# EAGLE design untitled (EAGLE 9.6.1)
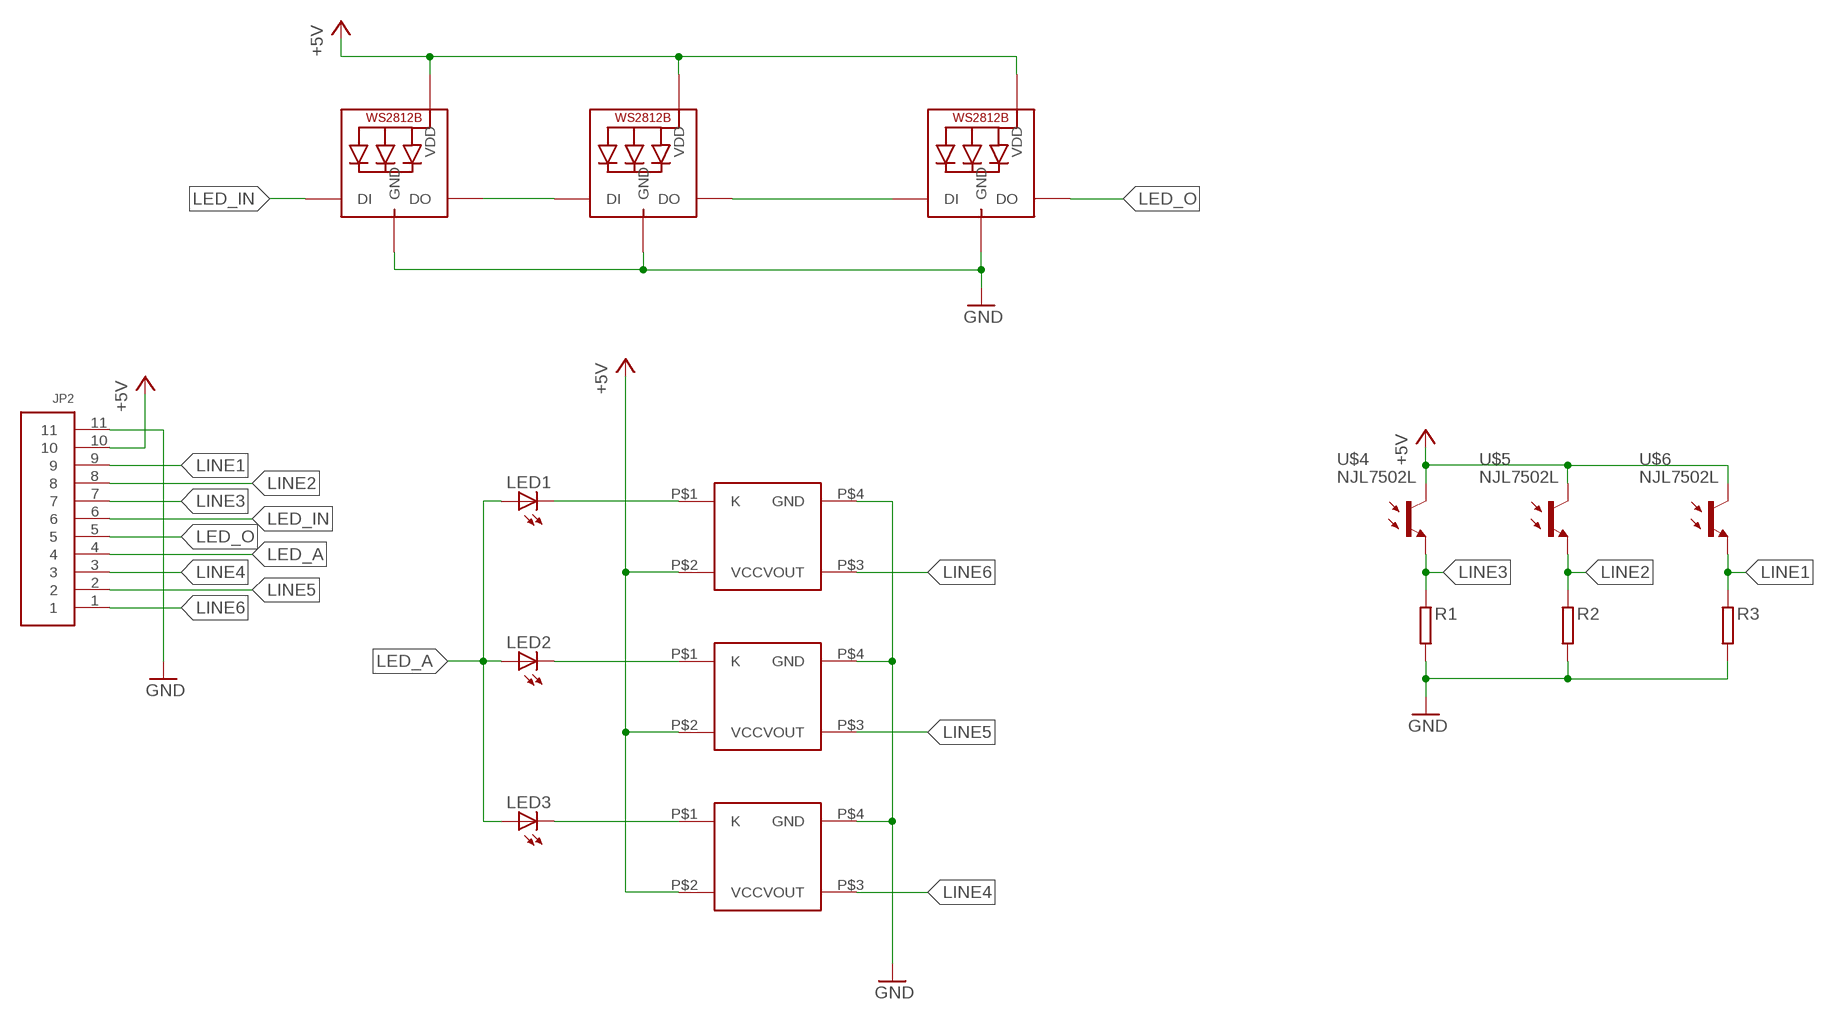
[diagram p0: schematic, sheet 1]

## Parts
JP2  11PIN  [B11B-PH-K-S]
LED1  LED5MM  [LED5MM]
LED2  LED5MM  [LED5MM]
LED3  LED5MM  [LED5MM]
LED4  WS2812B_5050N  [WS2812B-NARROW]
LED5  WS2812B_5050N  [WS2812B-NARROW]
LED6  WS2812B_5050N  [WS2812B-NARROW]
R1  RESISTOR1608  [SMD1608]
R2  RESISTOR1608  [SMD1608]
R3  RESISTOR1608  [SMD1608]
U$1  S4282-51  [S4282-51]
U$2  S4282-51  [S4282-51]
U$3  S4282-51  [S4282-51]
U$4  NJL7502L  [NJL7502L]
U$5  NJL7502L  [NJL7502L]
U$6  NJL7502L  [NJL7502L]

## Nets
+5V: JP2.10 LED4.1-VDD(VDD) LED5.1-VDD(VDD) LED6.1-VDD(VDD) U$1.P$2(VCC) U$2.P$2(VCC) U$3.P$2(VCC) U$4.C U$5.C U$6.C
GND: JP2.11 LED4.3-GND(GND) LED5.3-GND(GND) LED6.3-GND(GND) R1.2 R2.2 R3.2 U$1.P$4(GND) U$2.P$4(GND) U$3.P$4(GND)
LED_A: JP2.4 LED1.A LED2.A LED3.A
LED_IN: JP2.6 LED6.4-DIN(DI)
LED_O: JP2.5 LED4.2-DOUT(DO)
LINE1: JP2.9 R3.1 U$6.E
LINE2: JP2.8 R2.1 U$5.E
LINE3: JP2.7 R1.1 U$4.E
LINE4: JP2.3 U$3.P$3(VOUT)
LINE5: JP2.2 U$2.P$3(VOUT)
LINE6: JP2.1 U$1.P$3(VOUT)
N$1: LED1.K(C) U$1.P$1(K)
N$2: LED2.K(C) U$2.P$1(K)
N$3: LED3.K(C) U$3.P$1(K)
N$6: LED5.4-DIN(DI) LED6.2-DOUT(DO)
N$7: LED4.4-DIN(DI) LED5.2-DOUT(DO)

## Library data of the parts
JP2 = jst_eph:11PIN
LED1-LED3 = adafruit:LED: LED OSRAM: - CHIPLED LG R971, LG N971, LY N971, LG Q971, LY Q971, LO R971, LY R971 LH N974, LH R974 LS Q976, LO Q976, LY Q976 LO Q996 - Hyper CHIPLED LW Q18S LB Q993, LB Q99A, LB R99A - SideLED LS A670, LO A670, LY A670, LG A670, LP A670 LB A673, LV A673, LT A673, LW A673 LH A674 LY A675 LS A676, LA A676, LO A676, LY A676, LW A676 LS A679, LY A679, LG A679 - Hyper Micro SIDELED® LS Y876, LA Y876, LO Y876, LY Y876 LT Y87S - SmartLED LW L88C, LW L88S LB L89C, LB L89S, LG L890 LS L89K, LO L89K, LY L89K LS L896, LA L896, LO L896, LY L896 - TOPLED LS T670, LO T670, LY T670, LG T670, LP T670 LSG T670, LSP T670, LSY T670, LOP T670, LYG T670 LG T671, LOG T671, LSG T671 LB T673, LV T673, LT T673, LW T673 LH T674 LS T676, LA T676, LO T676, LY T676, LB T676, LH T676, LSB T676, LW T676 LB T67C, LV T67C, LT T67C, LS T67K, LO T67K, LY T67K, LW E67C LS E67B, LA E67B, LO E67B, LY E67B, LB E67C, LV E67C, LT E67C LW T67C LS T679, LY T679, LG T679 LS T770, LO T770, LY T770, LG T770, LP T770 LB T773, LV T773, LT T773, LW T773 LH T774 LS E675, LA E675, LY E675, LS T675 LS T776, LA T776, LO T776, LY T776, LB T776 LHGB T686 LT T68C, LB T68C - Hyper Mini TOPLED® LB M676 - Mini TOPLED Santana® LG M470 LS M47K, LO M47K, LY M47K Source: http://www.osram.convergy.de/
LED4-LED6 = adafruit:WS2812B
R1-R3 = generic:RESISTOR: Generic Registor
U$1-U$3 = S4282-51:S4282-51
U$4-U$6 = by_hirame:NJL7502L

## Board
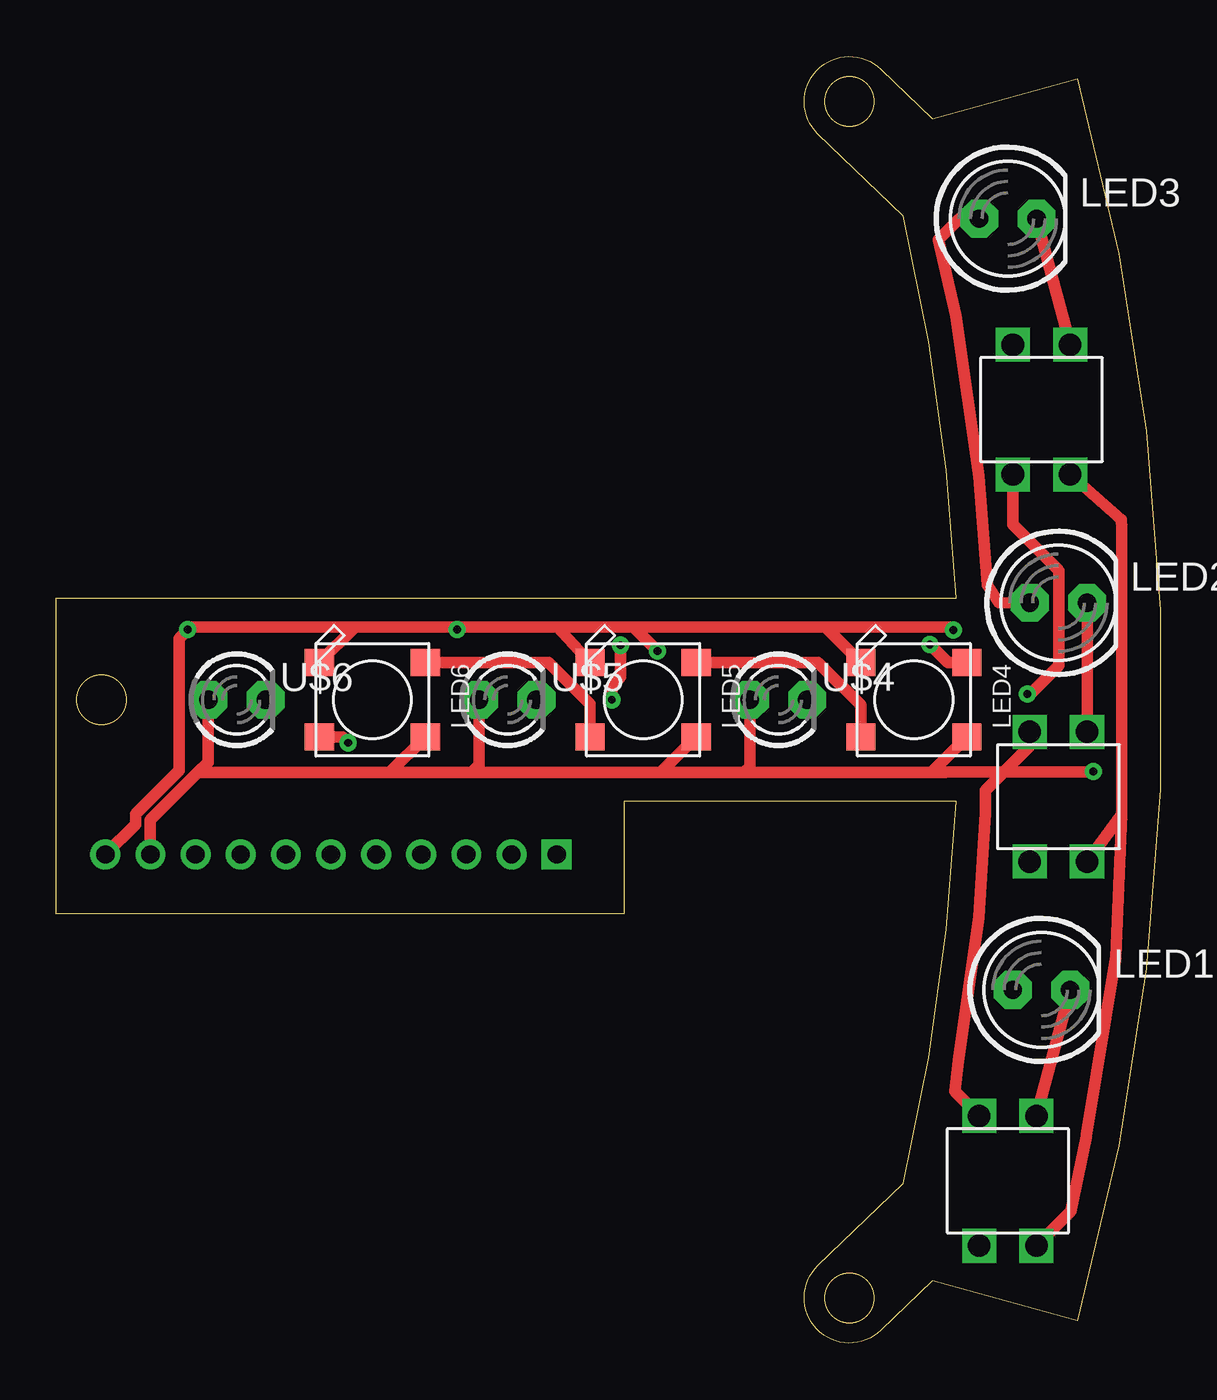
[diagram p1: board, top side]
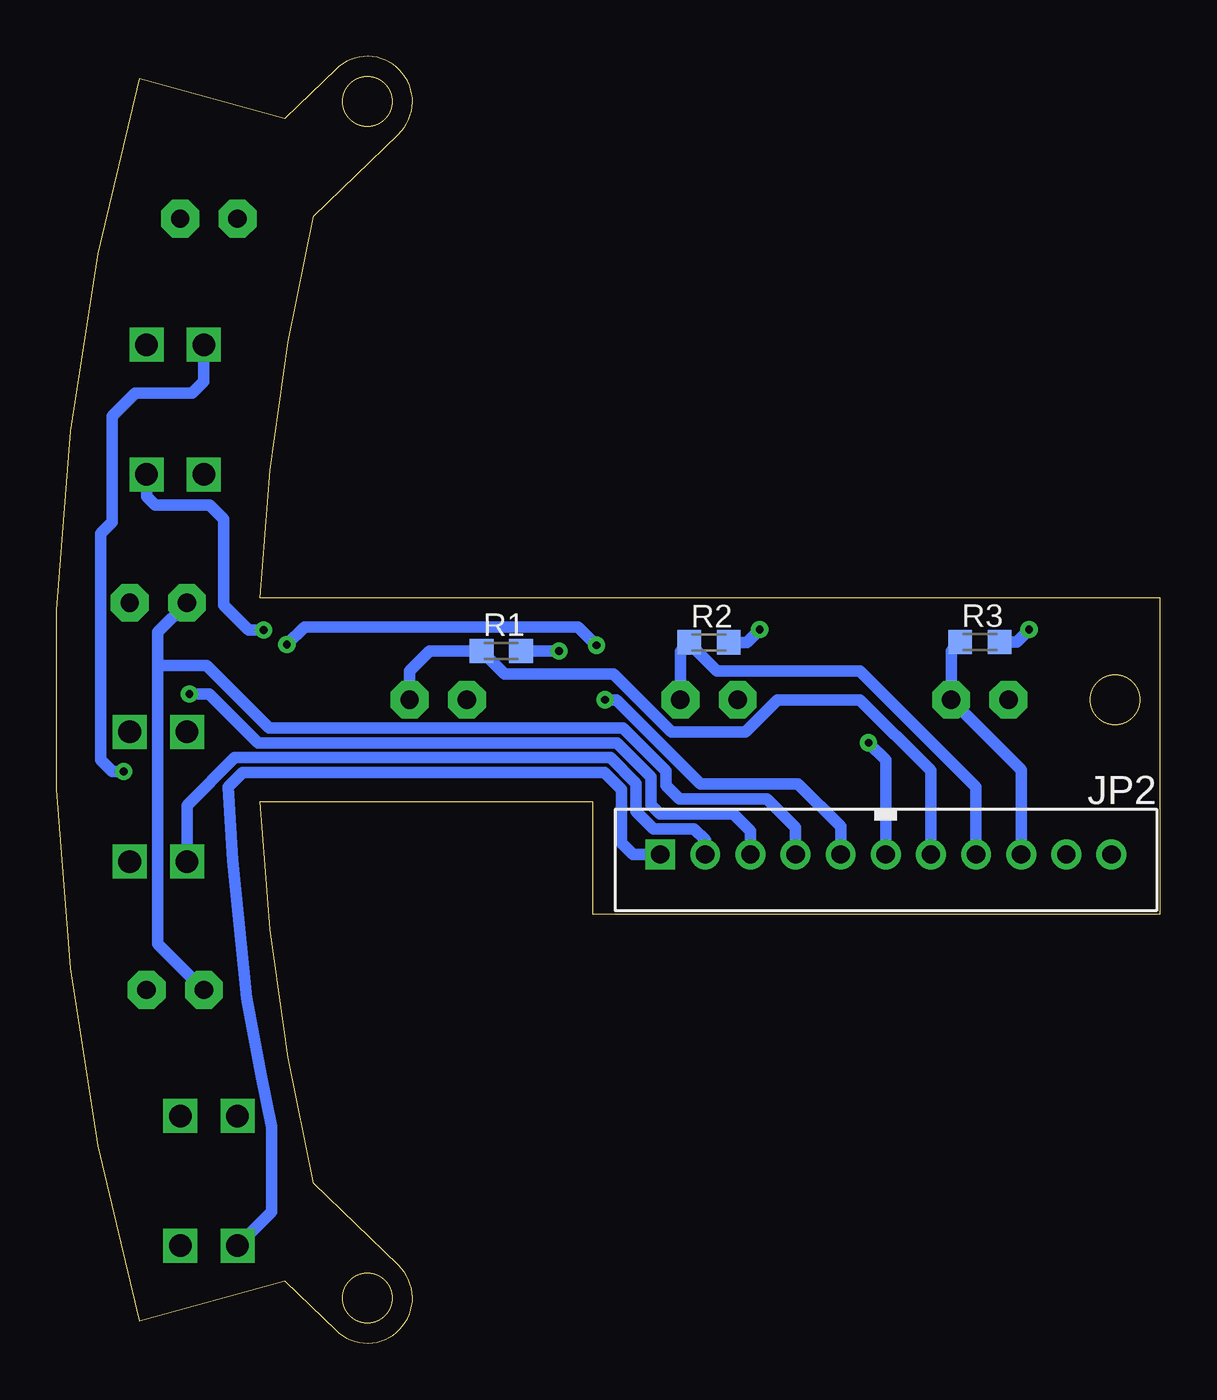
[diagram p2: board, bottom side, seen from below]

Size 48.92 x 57.02 mm. Coordinates in mm from the lower left corner, seen from the top.
Outline: 39.89,33.01 arc10 37.53,49.94 33.75,53.58 arc-180 36.53,56.46 38.82,54.25 45.25,56.04 arc-31 45.25,0.98 38.82,2.77 36.53,0.56 arc-180 33.75,3.44 37.53,7.08 arc10 39.89,24.01 25.16,24.01 25.16,19.01 0,19.01 0,33.01 39.89,33.01
Outline: circle at 35.14,2 radius 1.1
Outline: circle at 35.14,55.02 radius 1.1
Outline: circle at 2,28.51 radius 1.1
Copper layers (1*16): Top 0.035mm / dielectric 1.5mm / Bottom 0.035mm
Design rules "default": minimum track width 6mil, minimum drill 0.35mm, track to track 6mil, track to pad 6mil, pad to pad 6mil, via to via 6mil, smd to smd 6mil, copper to edge 40mil, drill to drill 6mil, minimum pad ring 10mil, minimum via ring 8mil, stop-mask expansion 4mil, vias tented up to drill 0mil, thermal gap 10mil

### Footprints (pad centres in the part's own frame; a part is rotated, then mirrored left to right if it is on the bottom)
B11B-PH-K-S = drill 0.813 square: 1 10,0 | drill 0.813: 2 8,0; 3 6,0; 4 4,0; 5 2,0; 6 0,0; 7 -2,0; 8 -4,0; 9 -6,0; 10 -8,0; 11 -10,0
LED5MM = drill 0.813 pad 1.676 octagon: A -1.27,0; K 1.27,0
WS2812B-NARROW = smd 1.3 x 1.2: 1-VDD 2.35,-1.65; 2-DOUT 2.35,1.65; 3-GND -2.35,1.65; 4-DIN -2.35,-1.65
SMD1608 = smd 1.05 x 1.08: 1 -0.875,0; 2 0.875,0
S4282-51 = drill 1 square: P$1 -2.875,1.27; P$2 -2.875,-1.27; P$3 2.875,-1.27; P$4 2.875,1.27
NJL7502L = drill 0.813 pad 1.676 octagon: C -1.27,0; E 1.27,0

### Placement (x,y rotation side)
JP2  12.17,21.65 180 bottom
LED1  43.66,15.65 0 top
LED2  44.41,32.81 0 top
LED3  42.17,49.83 0 top
LED4  38,28.51 0 top
LED5  26,28.51 0 top
LED6  14,28.51 0 top
R1  29.21,30.67 0 bottom
R2  20,31.05 0 bottom
R3  8,31.07 0 bottom
U$1  42.17,7.19 270 top
U$2  44.41,24.21 270 top
U$3  43.66,41.37 270 top
U$4  32,28.51 0 top
U$5  20,28.51 0 top
U$6  8,28.51 0 top

### Tracks (layer width: path | path; a pad name or v marks a point on that pad's centre or on a via)
+5V  (via drill 0.35)
  Top 0.508: LED4.1-VDD 38.77,25.28 | 6.27,25.28 14.77,25.28 | 14.77,25.28 18.39,25.28 | 18.39,25.28 26.77,25.28 | 26.77,25.28 30.45,25.28 | 30.45,25.28 38.77,25.28 | LED6.1-VDD 14.77,25.28 | LED5.1-VDD 26.77,25.28 | U$5.C 18.73,25.62 18.39,25.28 | U$4.C 30.73,25.56 30.45,25.28 | 6.27,25.28 6.73,25.74 U$6.C | JP2.10 4.17,23.18 6.27,25.28 | 38.77,25.28 39.4,25.28 39.42,25.3 41.99,25.3 | U$2.P$2 43.14,26.45 41.99,25.3 | U$1.P$2 39.81,11.15 39.98,12.51 40.87,18.86 41.16,23.48 41.16,24.48 41.99,25.3 | 41.99,25.3 45.92,25.3 v45.95,25.33
  Bottom 0.508: U$3.P$2 42.39,42.61 42.9,42.1 45.44,42.1 46.46,41.08 46.46,36.38 46.97,35.88 46.97,25.84 46.46,25.33 v45.95,25.33
GND  (via drill 0.35)
  Top 0.508: LED6.3-GND 13.23,31.74 | LED5.3-GND 22.2,31.74 | 13.23,31.74 17.75,31.74 | 17.75,31.74 22.2,31.74 | 34.07,31.74 LED4.3-GND | 34.07,31.74 25.58,31.74 | 25.58,31.74 22.2,31.74 | U$3.P$4 47.19,36.49 47.22,36.1 47.22,23.43 | 47.22,23.43 U$2.P$4 | 47.22,23.43 46.96,17.12 45.64,9.2 45.64,9.15 44.96,5.84 U$1.P$4 | v17.75,31.61 17.75,31.74 | 13.23,31.74 5.94,31.74 v5.82,31.61 5.44,31.23 5.44,25.38 3.51,23.45 3.51,22.99 JP2.11 | 34.07,31.74 39.4,31.74 39.42,31.72 39.63,31.72 v39.75,31.61 | v26.64,30.67 25.58,31.74
  Bottom 0.508: R2.2 18.32,31.05 v17.75,31.61 | R3.2 6.36,31.07 v5.82,31.61 | v39.75,31.61 40.41,31.61 41.5,32.7 41.5,36.51 42.14,37.15 44.55,37.15 44.93,37.52 U$3.P$4 | R1.2 v26.64,30.67
LED_A
  Top 0.508: LED3.A 40.01,49.83 39.08,48.9 39.85,45.53 40.87,38.42 41.25,33.59 41.76,32.83 LED2.A
  Bottom 0.508: LED1.A 44.42,17.69 44.42,30.03 | LED2.A 44.42,31.52 44.42,30.03 | JP2.4 16.17,22.86 17.42,24.12 21.31,24.12 21.91,24.71 21.91,25.36 23.81,27.26 38.71,27.26 39.24,27.26 39.49,27.26 42.27,30.03 44.42,30.03
LED_IN  (via drill 0.35)
  Top 0.508: LED6.4-DIN 12.67,26.86 v12.93,26.6
  Bottom 0.508: v12.93,26.6 12.17,25.84 JP2.6
LED_O  (via drill 0.35)
  Top 0.508: v24.61,28.51 24.61,29.14 24.99,29.53 v24.99,30.92 | v38.71,30.95 39.5,30.16 LED4.2-DOUT
  Bottom 0.508: JP2.5 14.17,22.89 16.05,24.78 20.37,24.78 24.11,28.51 v24.61,28.51 | v24.99,30.92 25.81,31.74 37.92,31.74 v38.71,30.95
LINE1
  Bottom 0.508: R3.1 9.27,30.67 U$6.E 6.84,26.08 6.5,25.74 6.17,25.41 JP2.9
LINE2
  Bottom 0.508: U$5.E 21.27,30.65 R2.1 20.88,30.99 19.66,29.78 13.31,29.78 8.17,24.64 JP2.8
LINE3
  Bottom 0.508: JP2.7 10.17,25.37 13.31,28.51 16.97,28.51 18.39,27.09 21.67,27.09 24.23,29.65 29.06,29.65 R1.1 32.38,30.67 33.27,29.78 U$4.E
LINE4  (via drill 0.35)
  Top 0.508: U$3.P$3 42.39,36.26 44.42,34.22 44.42,30.03 43.16,28.76 v43.03,28.76
  Bottom 0.508: JP2.3 18.17,22.7 18.92,23.45 22.18,23.45 22.57,23.84 22.57,25.08 24.09,26.6 39.98,26.6 42.14,28.76 v43.03,28.76
LINE5
  Bottom 0.508: JP2.2 20.17,22.29 20.68,22.79 22.45,22.79 23.23,23.57 23.23,24.81 24.36,25.94 41.03,25.94 43.14,23.83 U$2.P$3
LINE6
  Bottom 0.508: JP2.1 23.38,21.65 23.89,22.16 23.89,24.54 24.63,25.28 40.67,25.28 41.31,24.64 41.12,21.4 40.49,15.3 39.85,11.87 39.39,9.58 39.39,5.82 U$1.P$3
N$1
  Top 0.508: U$1.P$1 LED1.K
N$2
  Top 0.508: LED2.K U$2.P$1
N$3
  Top 0.508: LED3.K U$3.P$1
N$6
  Top 0.508: LED6.2-DOUT 21.82,30.16 23.65,28.33 LED5.4-DIN
N$7
  Top 0.508: LED5.2-DOUT 33.76,30.16 35.65,28.27 LED4.4-DIN